# Altium schematic sheet MCU_Connectors.SchDoc
size A; SheetNumber: 8; SheetTotal: 8
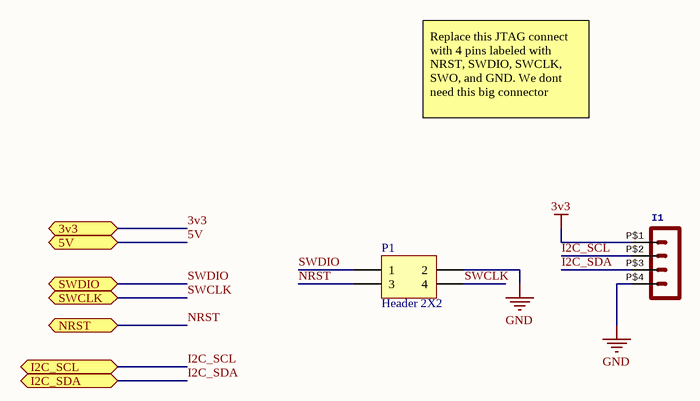
[diagram p0: MCU_Connectors.SchDoc]

## Parts
I1  Molex - Micro-Fit 3.0 Series connector,  3.00mm (0.118") pitch header, 4 positions.  [44914-0401]  (value not drawn)
P1  Header 2X2  [HDR2X2]

## Ports
3v3 (bidir), 5V (bidir), I2C_SCL (bidir), I2C_SDA (bidir), NRST (bidir), SWCLK (bidir), SWDIO (bidir)

## Nets
3v3: I1.P$1 ; port 3v3
GND: I1.P$4 P1.2
5V: port 5V
I2C_SCL: I1.P$2 ; port I2C_SCL
I2C_SDA: I1.P$3 ; port I2C_SDA
NRST: P1.3 ; port NRST
SWCLK: P1.4 ; port SWCLK
SWDIO: P1.1 ; port SWDIO

## Notes on the sheet
- Replace this JTAG connect with 4 pins labeled with NRST, SWDIO, SWCLK, SWO, and GND. We dont need this big connector

## Library data of the parts
I1 = HEADER_POS4_?44914-0401: GateName_1: G$1; SymbolName_1: HEADER_POS4; DeviceName: 44914-0401; LibraryName: con-molex-micro-fit-3_0_2; DeviceSetName: HEADER_POS4_?; Package: 44914-0401
P1 = Header 2X2: Header, 2-Pin, Dual row; LatestRevisionDate: 17-Jul-2002; LatestRevisionNote: Re-released for DXP Platform.; Publisher: Altium Limited